# Altium project AD9864.PrjPcb
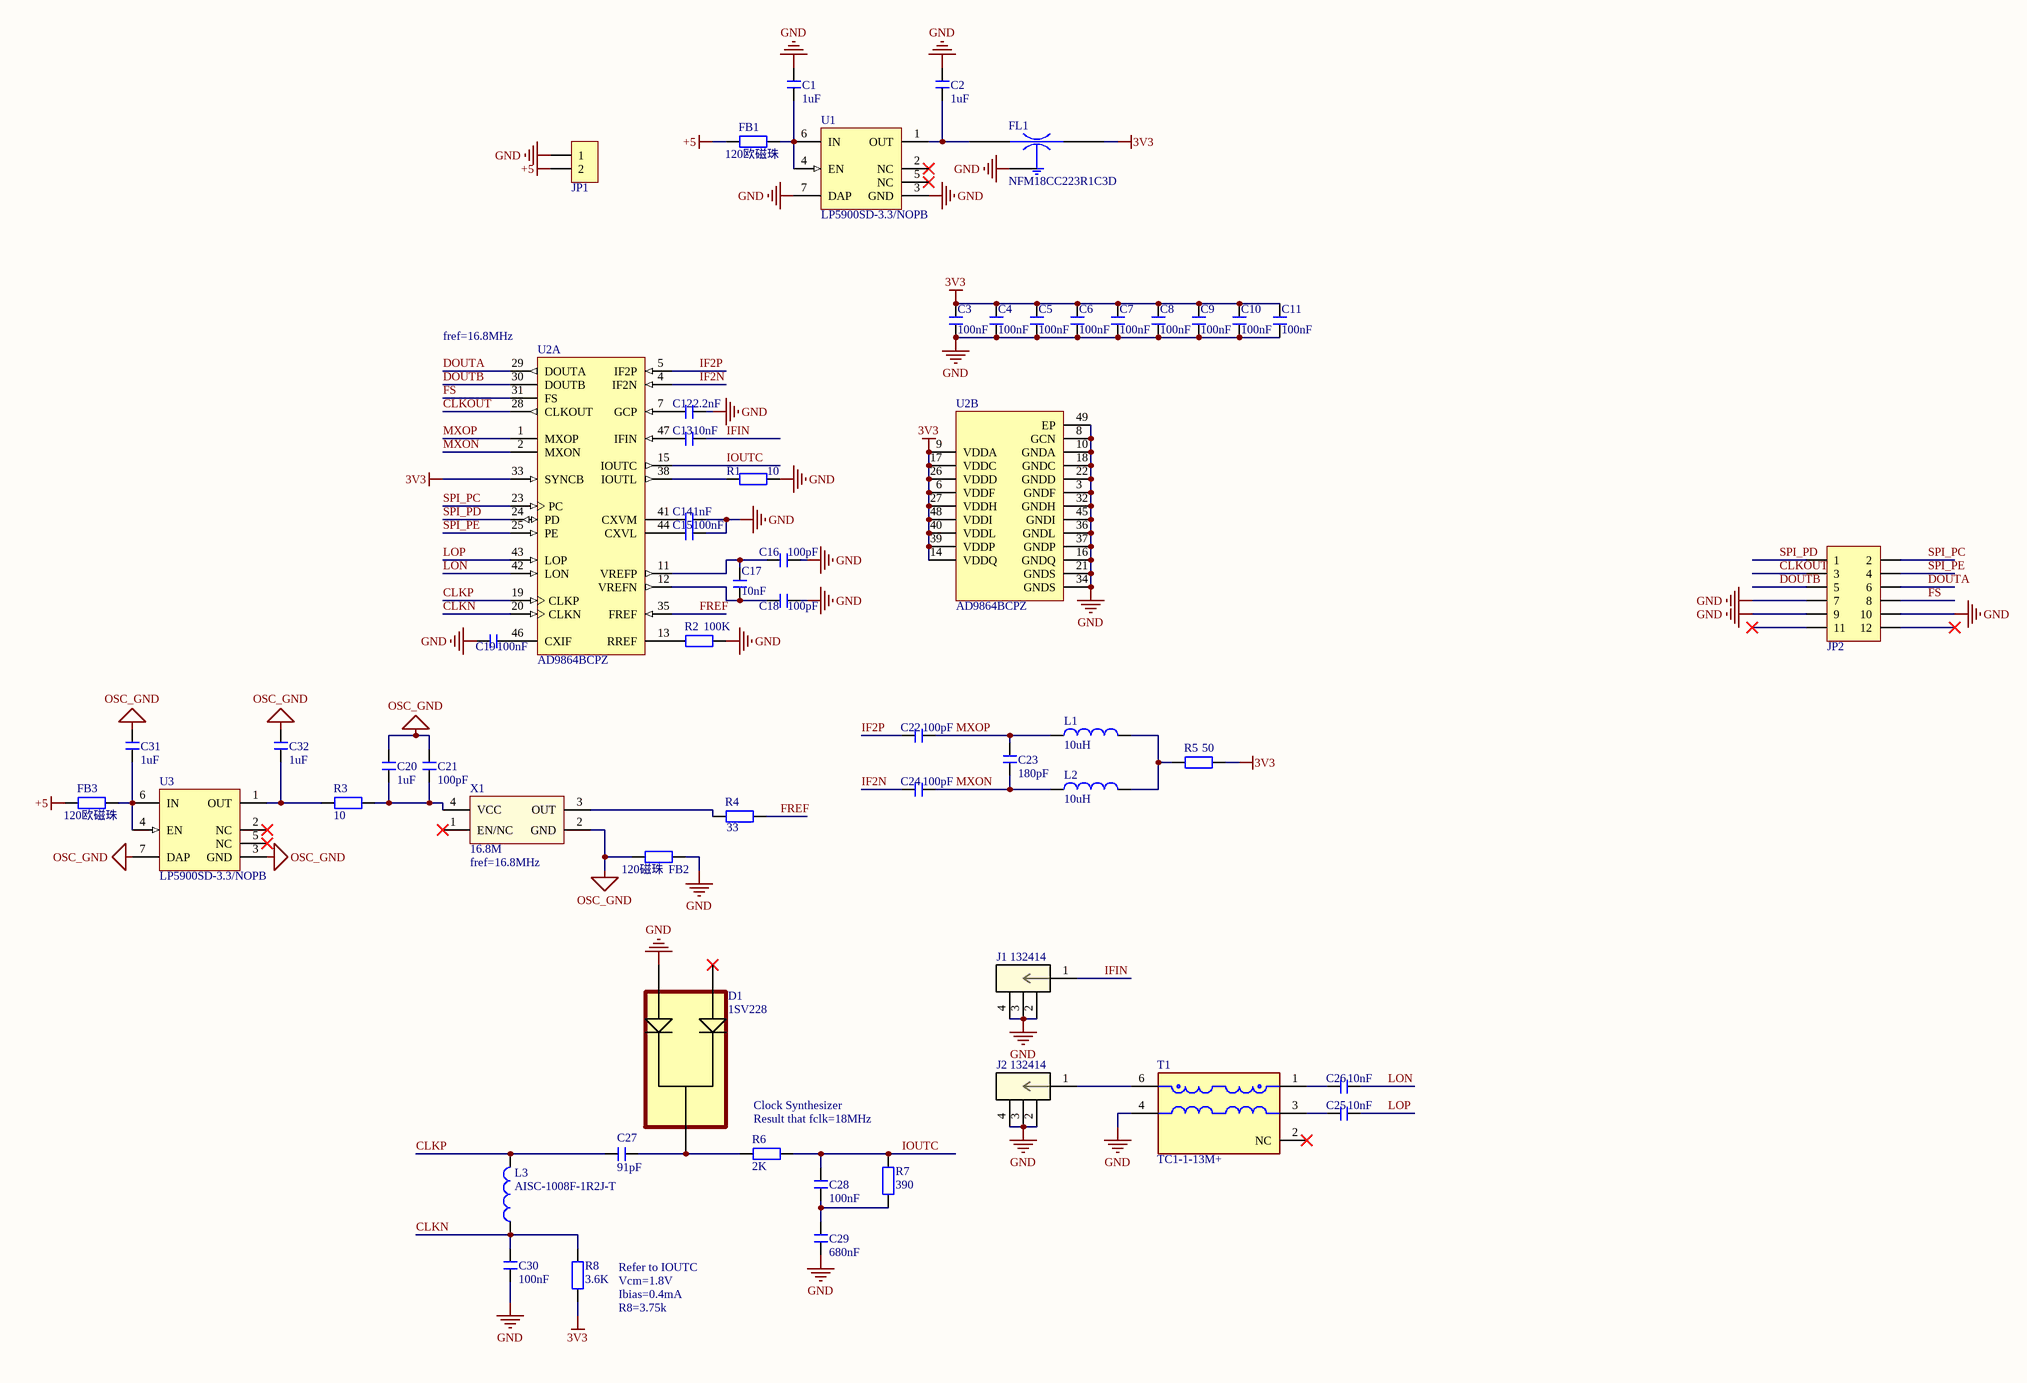
[diagram p0: AD9864.SchDoc]
1 sheet, 57 parts. Net scope: global (net labels, ports and power ports of the same name join across sheets).
Board file: AD9864.PcbDoc

## Sheet AD9864.SchDoc
size A2; SheetNumber: 1; SheetTotal: 1; SPICEModelCachePAOMWVMT: <root> / <DocumentId>PAOMWVMT</DocumentId> / </root>

### Parts
C1  1uF  [C 0603_L]
C2  1uF  [C 0603_L]
C3  100nF  [C 0402_L]
C4  100nF  [C 0402_L]
C5  100nF  [C 0402_L]
C6  100nF  [C 0402_L]
C7  100nF  [C 0402_L]
C8  100nF  [C 0402_L]
C9  100nF  [C 0402_L]
C10  100nF  [C 0402_L]
C11  100nF  [C 0402_L]
C12  2.2nF  [C 0402_L]
C13  10nF  [C 0402_L]
C14  1nF  [C 0402_L]
C15  100nF  [C 0402_L]
C16  100pF  [C 0402_L]
C17  10nF  [C 0402_L]
C18  100pF  [C 0402_L]
C19  100nF  [C 0402_L]
C20  1uF  [C 0603_L]
C21  100pF  [C 0603_L]
C22  100pF  [C 0402_L]
C23  180pF  [C 0402_L]
C24  100pF  [C 0402_L]
C25  10nF  [C 0402_L]
C26  10nF  [C 0402_L]
C27  91pF  [C 0402_L]
C28  100nF  [C 0402_L]
C29  680nF  [C 0402_L]
C30  100nF  [C 0402_L]
C31  1uF  [C 0603_L]
C32  1uF  [C 0603_L]
D1  1SV228  [TRANS_SSM3J325F,LF]
FB1  120欧磁珠  [R 0603_L]
FB2  120磁珠  [R 0603_L]
FB3  120欧磁珠  [R 0603_L]
FL1  NFM18CC223R1C3D  [FIL_NFM18CC223R1C3D]
J1  132414  [CONN_132414_AMP]
J2  132414  [CONN_132414_AMP]
JP1  HDR-1X2  [KF2510-LI-2P]  (value not drawn)
JP2  Header 6X2  [HDR2.54-WI-2x6P]  (value not drawn)
L1  10uH  [L 0603]
L2  10uH  [L 0603]
L3  AISC-1008F-1R2J-T  [IND-SMD_L2.9-W2.8]
R1  10  [R 0402_L]
R2  100K  [R 0402_L]
R3  10  [R 0603_L]
R4  33  [R 0603_L]
R5  50  [R 0402_L]
R6  2K  [R 0402_L]
R7  390  [R 0402_L]
R8  3.6K  [R 0603_L]
T1  TC1-1-13M+  [FP-TC1-1-13M+-MFG]
U1  LP5900SD-3.3/NOPB  [NGF0006A_V]
U2  AD9864BCPZ  [CP-48-1_M]  (parts A,B of 2)
U3  LP5900SD-3.3/NOPB  [NGF0006A_V]
X1  16.8M  [OSC 3225-4P]

### Nets
3V3: C3.2 C4.2 C5.2 C6.2 C7.2 C8.2 C9.2 C10.2 C11.2 FL1.3 R5.2 R8.1 U2.6(VDDF) U2.9(VDDA) U2.14(VDDQ) U2.17(VDDC) U2.26(VDDD) U2.27(VDDH) U2.33(SYNCB) U2.39(VDDP) U2.40(VDDL) U2.48(VDDI)
+5: FB1.1 FB3.1 JP1.2
GND: C1.2 C2.2 C3.1 C4.1 C5.1 C6.1 C7.1 C8.1 C9.1 C10.1 C11.1 C12.2 C14.1 C15.1 C16.2 C18.2 C19.1 C29.1 C30.1 D1.2 FB2.2 FL1.2(GND) J1.2 J1.3 J1.4 J2.2 J2.3 J2.4 JP1.1 JP2.7 JP2.9 JP2.10 R1.2 R2.2 T1.4(PRIMARY) U1.3(GND) U1.7(DAP) U2.3(GNDF) U2.8(GCN) U2.10(GNDA) U2.16(GNDQ) U2.18(GNDC) U2.21(GNDS) U2.22(GNDD) U2.32(GNDH) U2.34(GNDS) U2.36(GNDL) U2.37(GNDP) U2.45(GNDI) U2.49(EP)
OSC_GND: C20.2 C21.2 C31.2 C32.2 FB2.1 U3.3(GND) U3.7(DAP) X1.2(GND)
CLKN: C30.2 L3.1 R8.2 U2.20(CLKN)
CLKOUT: JP2.3 U2.28(CLKOUT)
CLKP: C27.2 L3.2 U2.19(CLKP)
DOUTA: JP2.6 U2.29(DOUTA)
DOUTB: JP2.5 U2.30(DOUTB)
FREF: R4.2 U2.35(FREF)
FS: JP2.8 U2.31(FS)
IF2N: C24.1 U2.4(IF2N)
IF2P: C22.1 U2.5(IF2P)
IFIN: C13.2 J1.1
IOUTC: C28.2 R6.1 R7.1 U2.15(IOUTC)
LON: C26.2 U2.42(LON)
LOP: C25.2 U2.43(LOP)
MXON: C23.1 C24.2 L2.1 U2.2(MXON)
MXOP: C22.2 C23.2 L1.1 U2.1(MXOP)
SPI_PC: JP2.2 U2.23(PC)
SPI_PD: JP2.1 U2.24(PD)
SPI_PE: JP2.4 U2.25(PE)
NetC1_1: C1.1 FB1.2 U1.4(EN) U1.6(IN)
NetC2_1: C2.1 FL1.1 U1.1(OUT)
NetC12_1: C12.1 U2.7(GCP)
NetC13_1: C13.1 U2.47(IFIN)
NetC14_2: C14.2 U2.41(CXVM)
NetC15_2: C15.2 U2.44(CXVL)
NetC16_1: C16.1 C17.2 U2.11(VREFP)
NetC17_1: C17.1 C18.1 U2.12(VREFN)
NetC19_2: C19.2 U2.46(CXIF)
NetC20_1: C20.1 C21.1 R3.2 X1.4(VCC)
NetC25_1: C25.1 T1.3(SECONDARY)
NetC26_1: C26.1 T1.1(SECONDARY_DOT)
NetC27_1: C27.1 D1.3 R6.2
NetC28_1: C28.1 C29.2 R7.2
NetC31_1: C31.1 FB3.2 U3.4(EN) U3.6(IN)
NetC32_1: C32.1 R3.1 U3.1(OUT)
NetJ2_1: J2.1 T1.6(PRIMARY_DOT)
NetL1_2: L1.2 L2.2 R5.1
NetR1_1: R1.1 U2.38(IOUTL)
NetR2_1: R2.1 U2.13(RREF)
NetR4_1: R4.1 X1.3(OUT)

Not connected (* = marked no-connect by the designer): D1 1*; JP2 11* 12*; T1 2(NC)*; U1 2(NC)* 5(NC)*; U3 2(NC)* 5(NC)*; X1 1(EN/NC)*

### Notes on the sheet
- (near U2) fref=16.8MHz
- (near X1) fref=16.8MHz
- Clock Synthesizer
- Result that fclk=18MHz
- (near R8) Refer to IOUTC
- (near R8) Vcm=1.8V
- (near R8) Ibias=0.4mA
- (near R8) R8=3.75k

### Library data of the parts
C1-C32 = C: 贴片电容; 淘宝ID: 小糖豆的小窝窝; BOM名称: 贴片电容; 下单链接: https://item.taobao.com/item.htm?ft=t&id=613637044352
D1 = 1SV228: Varactor 1 Pair Common Cathode 15V Surface Mount S-Mini; MF: Toshiba; Availability: In Stock; Check_prices: https://www.snapeda.com/parts/1SV228/Toshiba/view-part/?ref=eda; SnapEDA_Link: https://www.snapeda.com/parts/1SV228/Toshiba/view-part/?ref=snap; MP: 1SV228; Value: *; Price: None; Package: SC-59 Toshiba; Purchase-URL: https://pricing.snapeda.com/search/part/1SV228/?ref=eda
FB1-FB3 R1-R8 = R: 贴片电阻; 淘宝ID: 小糖豆的小窝窝; BOM名称: 贴片电阻; 下单链接: https://item.taobao.com/item.htm?ft=t&id=613637044352
FL1 = NFM18CC223R1C3D: SMD Capacitor with Capacitance: 22000pF Tol. 20%. Rated Voltage: 16Vdc; MF: Murata; MP: NFM18CC223R1C3D; SnapEDA_Link: https://www.snapeda.com/parts/NFM18CC223R1C3D/Murata/view-part/?ref=snap; Availability: In Stock; Package: NONSTANDARD; Check_prices: https://www.snapeda.com/parts/NFM18CC223R1C3D/Murata/view-part/?ref=eda; Value: *; Purchase-URL: https://pricing.snapeda.com/search/part/NFM18CC223R1C3D/?ref=eda; Price: None
J1 J2 = 132414: No Description Available; Mfr_Name: Amphenol ICC; Copyright: Copyright (C) 2022 Ultra Librarian. All rights reserved.; Manufacturer_Part_Number: 132414; RefDes: RefDes; Type: DEV
JP1 = Header 2: 2P接插件; 淘宝ID: 小糖豆的小窝窝; BOM名称: 2P接插件; 下单链接: https://item.taobao.com/item.htm?ft=t&id=613637044352
JP2 = Header  6X2: 6*2P接插件; 淘宝ID: 小糖豆的小窝窝; BOM名称: 6*2P接插件; 下单链接: https://item.taobao.com/item.htm?ft=t&id=613637044352
L1-L3 = L: 小功率贴片电感; BOM名称: 小功率贴片电感; 下单链接: https://item.taobao.com/item.htm?ft=t&id=613637044352
T1 = CMP-00025-00004-1: RF Transformer 1: 1 5 Terminal SMD; RoHS Compliant: Yes
U1 U3 = CMP-019-00050-1: 150-mA, low-noise, low-IQ, low-dropout voltage regulator with enable 6-WSON -40 to 125; Min Supply Voltage: 2.5V; Output Current: 150mA; Max Supply Voltage: 5.5V; Output Voltage: 3.3V; Dropout Voltage: 80mV; Mounting Technology: Surface Mount; Max Operating Temperature: 85°C; Pins: 6; Min Operating Temperature: -40°C
U2 = CMP-00025-00003-1: IC IF SUBSYSTEM GEN-PURP 48LFCSP; Frequency: 300MHz; Min Operating Temperature: -40°C; Pins: 48; Max Operating Temperature: 85°C; RoHS Compliant: Yes
X1 = XTAL-ACT-4P: 4脚有源晶振; 淘宝ID: 小糖豆的小窝窝; BOM名称: 4脚有源晶振; 下单链接: https://item.taobao.com/item.htm?ft=t&id=613637044352